# EAGLE design Variable Voltage (EAGLE 9.6.2)
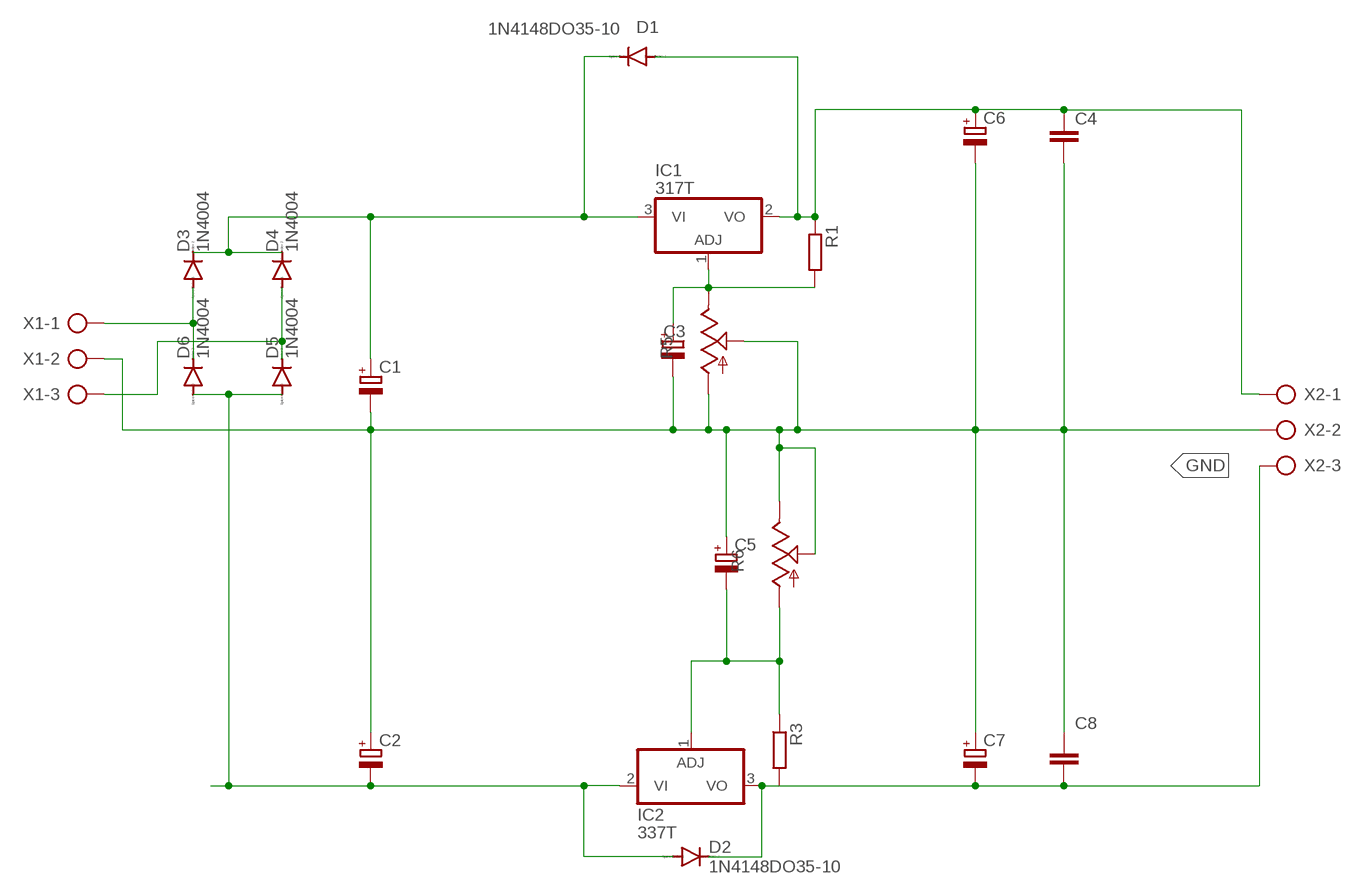
[diagram p0: schematic, sheet 1]

## Parts
C1  CPOL-EUE5-8.5  [E5-8,5]
C2  CPOL-EUE5-8.5  [E5-8,5]
C3  CPOL-EUE2-4  [E2-4]
C4  C2,5-3  [C2.5-3]
C5  CPOL-EUE2-4  [E2-4]
C6  CPOL-EUE2.5-4V  [E2,5RE]
C7  CPOL-EUE2.5-4V  [E2,5RE]
C8  C2,5-3  [C2.5-3]
D1  1N4148DO35-10  [DO35-10]
D2  1N4148DO35-10  [DO35-10]
D3  1N4004  [DO41-10]
D4  1N4004  [DO41-10]
D5  1N4004  [DO41-10]
D6  1N4004  [DO41-10]
IC1  317T  [TO220H]
IC2  337T  [TO220H]
R1  R-EU_0204/7  [0204/7]
R3  R-EU_0204/7  [0204/7]
R5  TRIM_US-B25V  [B25V]
R6  TRIM_US-B25V  [B25V]
X1  AK300/3  [AK300/3]
X2  AK300/3  [AK300/3]

## Nets
GND: C1.- C2.+ C3.- C4.2 C5.+ C6.- C7.+ C8.1 R5.A R5.S R6.E R6.S X1.2 X2.2
N$1: D3.A D6.C X1.1
N$2: D4.A D5.C X1.3
N$3: C1.+ D1.C D3.C D4.C IC1.3(VI)
N$4: C2.- D2.A D5.A D6.A IC2.2(VI)
N$6: C3.+ IC1.1(ADJ) R1.2 R5.E
N$7: C5.- IC2.1(ADJ) R3.1 R6.A
N$8: C4.1 C6.+ D1.A IC1.2(VO) R1.1 X2.1
N$10: C7.- C8.2 D2.C IC2.3(VO) R3.2 X2.3

## Library data of the parts
C1-C3 C5-C7 = rcl:CPOL-EU: POLARIZED CAPACITOR, European symbol; SPICEPREFIX: C
C4 C8 = capacitor-wima:C: CAPACITOR naming: grid - package width
D1 D2 = diode:1N4148: DIODE high speed (Philips)
D3-D6 = diode:1N4004: DIODE general purpose rectifier, 1 A
IC1 = linear:*317: Positive VOLTAGE REGULATOR
IC2 = linear:*337: Negative VOLTAGE REGULATOR
R1 R3 = rcl:R-EU_: RESISTOR, European symbol; SPICEPREFIX: R
R5 R6 = pot:TRIM_US-: POTENTIOMETER
X1 X2 = con-ptr500:AK300/3: CONNECTOR; OC_FARNELL: unknown; OC_NEWARK: unknown

## Board
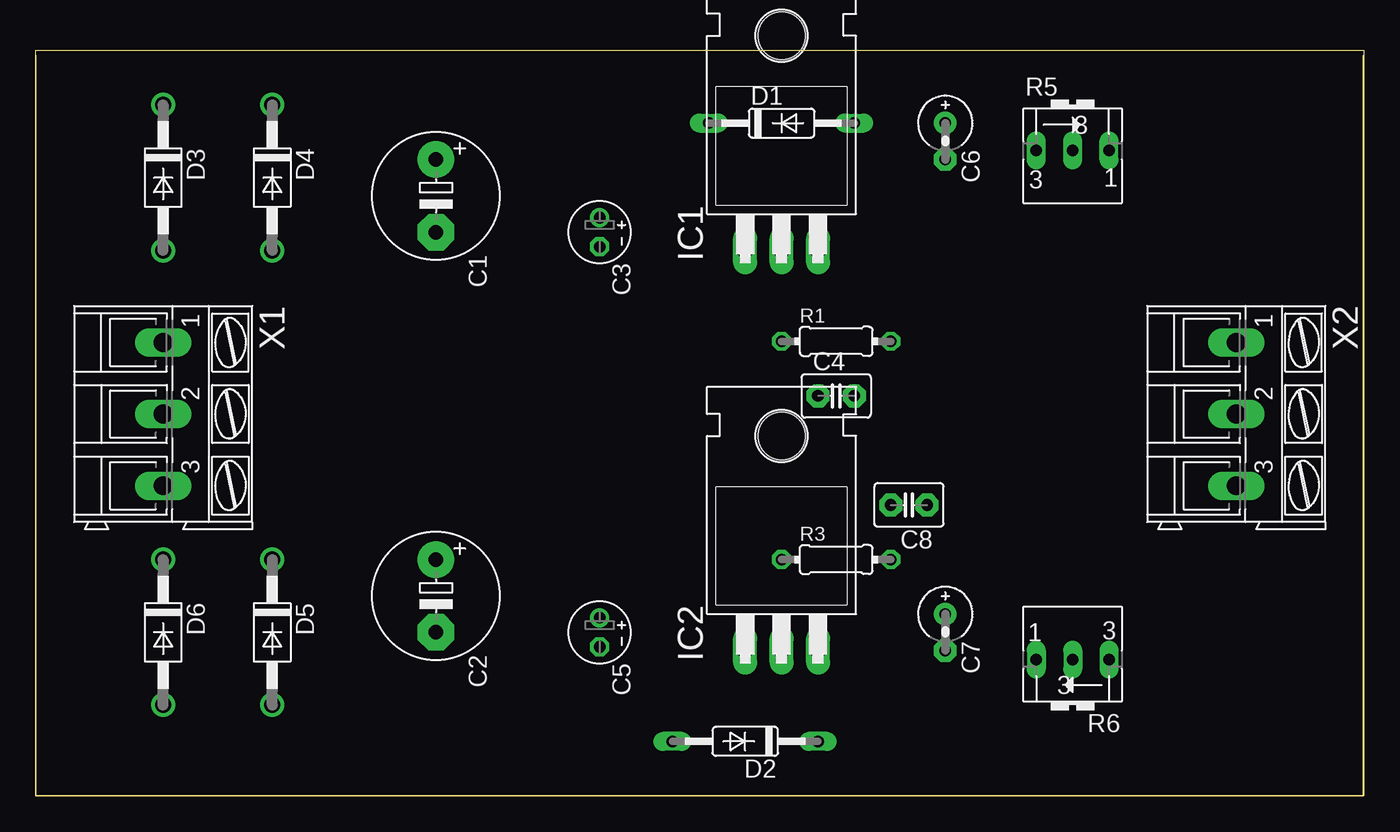
[diagram p1: board, top side]
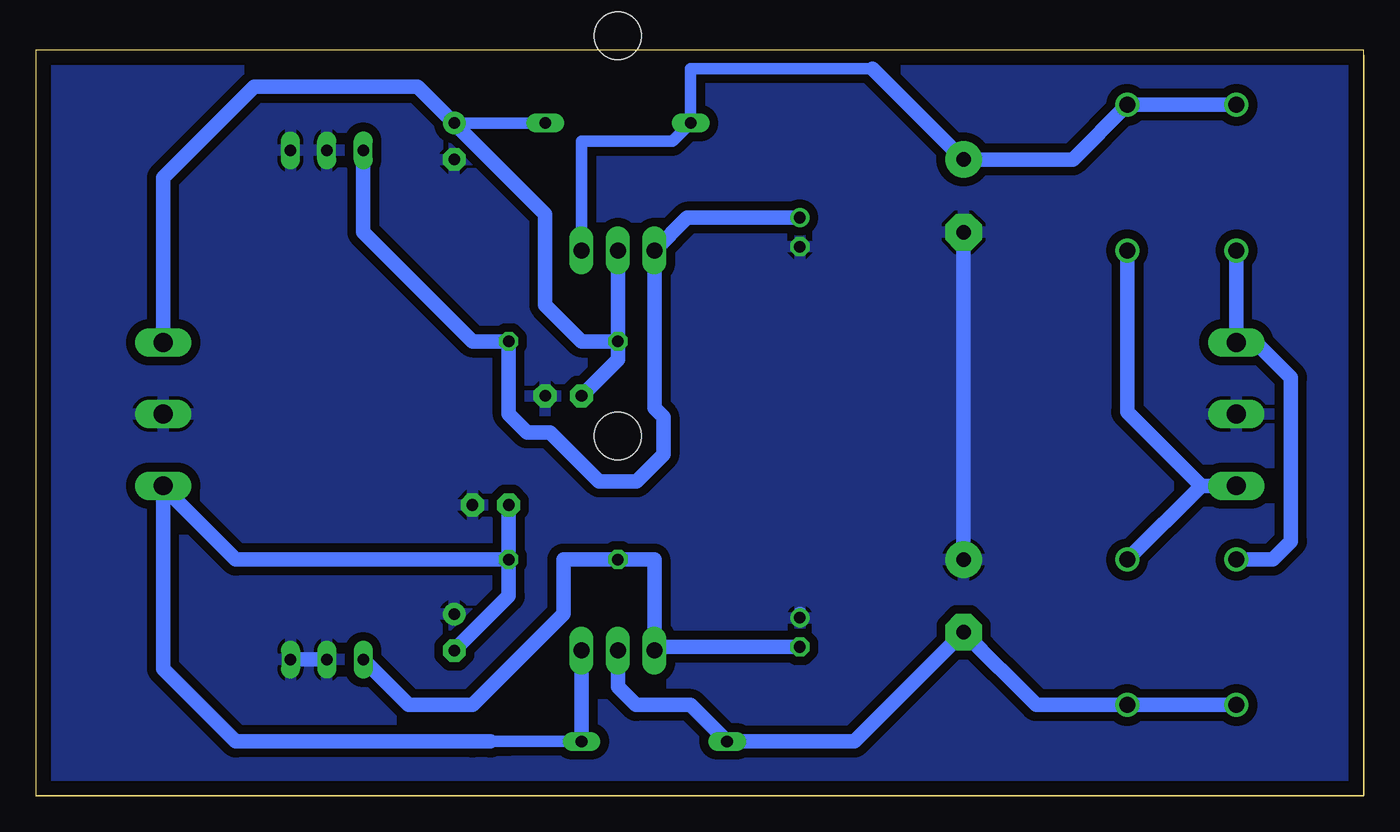
[diagram p2: board, bottom side, seen from below]

Size 92.71 x 52.07 mm. Coordinates in mm from the lower left corner, seen from the top.
Outline: 0,0 92.69,0 92.69,51.74
Outline: 0,51.74 0,0
Outline: 0,0 92.71,0 92.71,52.07 0,52.07 0,0
Copper layers (1*16): Top 0.035mm / dielectric 1.5mm / Bottom 0.035mm
Design rules "default *": minimum track width 32mil, minimum drill 0.35mm, track to track 16mil, track to pad 16mil, pad to pad 40mil, via to via 40mil, smd to smd 40mil, copper to edge 40mil, drill to drill 6mil, minimum pad ring 10mil, minimum via ring 8mil, stop-mask expansion 4mil, vias tented up to drill 0mil, thermal gap 10mil

### Footprints (pad centres in the part's own frame; a part is rotated, then mirrored left to right if it is on the bottom)
E5-8,5 = drill 1.016 pad 2.54: + -2.54,0 | drill 1.016 pad 2.54 octagon: - 2.54,0
E2-4 = drill 0.813 pad 1.27: + -1.016,0 | drill 0.813 pad 1.27 octagon: - 1.016,0
C2.5-3 = drill 0.813 pad 1.6 octagon: 1 -1.27,0; 2 1.27,0
E2,5RE = drill 0.813 pad 1.575: + -1.27,0 | drill 0.813 pad 1.575 octagon: - 1.27,0
DO35-10 = drill 0.813 long: A 5.08,0; C -5.08,0
DO41-10 = drill 1.118: A 5.08,0; C -5.08,0
TO220H = drill 1.118 long: 1 -2.54,-10.16; 2 0,-10.16; 3 2.54,-10.16 | hole 3.302: 0,4.826
0204/7 = drill 0.813 octagon: 1 -3.81,0; 2 3.81,0
B25V = drill 0.813 long: A 2.54,0.635; E -2.54,0.635; S 0,0.635
AK300/3 = drill 1.321 long: 1 -5.004,0; 2 0,0; 3 5.004,0

### Placement (x,y rotation side)
C1  27.94,41.91 270 top
C2  27.94,13.97 270 top
C3  39.37,39.37 270 top
C4  55.88,27.94 0 top
C5  39.37,11.43 270 top
C6  63.5,45.72 270 top
C7  63.5,11.43 270 top
C8  60.96,20.32 180 top
D1  52.07,46.99 0 top
D2  49.53,3.81 180 top
D3  8.89,43.18 270 top
D4  16.51,43.18 270 top
D5  16.51,11.43 270 top
D6  8.89,11.43 270 top
IC1  52.07,48.26 0 top
IC2  52.07,20.32 0 top
R1  55.88,31.75 0 top
R3  55.88,16.51 0 top
R5  72.39,44.45 0 top
R6  72.39,10.16 180 top
X1  8.89,26.67 270 top
X2  83.82,26.67 270 top

### Tracks (layer width: path | path; a pad name or v marks a point on that pad's centre or on a via)
GND
  Bottom 1.016: R6.S R6.E | C5.+ 39.37,12.7 | C1.- C2.+
  pour Bottom (isolate 0.61): 0,52.07 0,0 92.71,0 92.71,52.07
  pour Bottom (isolate 1.016, hatched): 92.71,52.07 0,52.07 0,0 92.71,0
N$1
  Bottom 1.016: D3.A X1.1 7.54,31.67 5.08,29.21 5.08,17.78 6.35,16.51 D6.C
N$2
  Bottom 1.016: D5.C 11.35,21.67 | 11.35,21.67 X1.3 | D4.A 16.51,26.82 11.35,21.67
N$3
  Bottom 0.813: 34.29,50.8 46.99,50.8 D1.C 48.26,45.72 54.61,45.72 IC1.3
  Bottom 1.016: D3.C D4.C 20.32,44.45 C1.+ 34.29,50.8
N$4
  Bottom 1.016: IC2.2 52.07,7.62 50.8,6.35 46.99,6.35 D2.A 35.56,3.81 C2.- | 26.67,10.16 C2.- | C2.- 22.86,6.35 D5.A D6.A
N$6
  Bottom 1.016: R5.E 69.85,39.37 62.23,31.75 R1.2 59.69,26.67 58.42,25.4 56.81,25.4 53.38,21.97 50.76,21.97 48.9,23.83 48.9,26.46 49.53,27.1 IC1.1 47.24,40.39 C3.+
N$7
  Bottom 1.016: C5.- 49.28,10.41 IC2.1 49.53,16.51 R3.1 55.88,16.51 55.88,12.7 62.23,6.35 66.67,6.35 R6.A
N$8
  Bottom 0.813: D1.A C6.+
  Bottom 1.016: IC1.2 R1.1 | C4.1 52.07,30.48 R1.1 | R1.1 54.61,31.75 57.15,34.29 57.15,40.64 C6.+ 66.04,49.53 77.47,49.53 83.82,43.18 X2.1
N$10
  Bottom 0.813: D2.C 59.69,3.81 62.23,3.81
  Bottom 1.016: C7.- 59.69,13.97 R3.2 | IC2.3 D2.C | 60.96,3.81 62.23,3.81 78.74,3.81 83.82,8.89 83.82,21.59 | 83.82,21.59 X2.3 | C8.2 R3.2 | R3.2 78.74,16.51 83.82,21.59